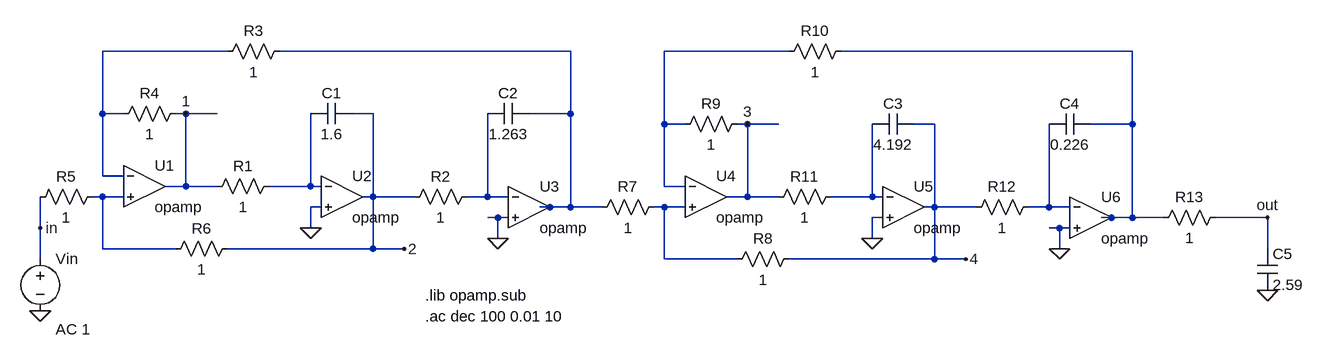
[diagram p0: schematic TS4.asc]
TS4.asc, the LTspice schematic file:
Version 4
SHEET 1 1776 680
WIRE 112 -48 -80 -48
WIRE 640 -48 192 -48
WIRE 976 -48 784 -48
WIRE 1504 -48 1056 -48
WIRE -80 48 -80 -48
WIRE -48 48 -80 48
WIRE 48 48 32 48
WIRE 96 48 48 48
WIRE 336 48 304 48
WIRE 640 48 640 -48
WIRE 640 48 576 48
WIRE 784 64 784 -48
WIRE 816 64 784 64
WIRE 912 64 896 64
WIRE 960 64 912 64
WIRE 1200 64 1168 64
WIRE 1504 64 1504 -48
WIRE 1504 64 1440 64
WIRE -80 144 -80 48
WIRE -48 144 -80 144
WIRE 48 160 48 48
WIRE 48 160 16 160
WIRE 96 160 48 160
WIRE 240 160 240 48
WIRE 240 160 176 160
WIRE 256 160 240 160
WIRE 784 160 784 64
WIRE 816 160 784 160
WIRE -80 176 -96 176
WIRE -48 176 -80 176
WIRE 336 176 336 48
WIRE 336 176 320 176
WIRE 400 176 336 176
WIRE 512 176 512 48
WIRE 512 176 480 176
WIRE 544 176 512 176
WIRE 912 176 912 64
WIRE 912 176 880 176
WIRE 960 176 912 176
WIRE 1104 176 1104 64
WIRE 1104 176 1040 176
WIRE 1120 176 1104 176
WIRE 256 192 240 192
WIRE 608 192 592 192
WIRE 640 192 640 48
WIRE 640 192 608 192
WIRE 688 192 640 192
WIRE 784 192 768 192
WIRE 816 192 784 192
WIRE 1200 192 1200 64
WIRE 1200 192 1184 192
WIRE 1264 192 1200 192
WIRE 1376 192 1376 64
WIRE 1376 192 1344 192
WIRE 1408 192 1376 192
WIRE 528 208 512 208
WIRE 544 208 528 208
WIRE 1120 208 1104 208
WIRE 1472 208 1456 208
WIRE 1504 208 1504 64
WIRE 1504 208 1472 208
WIRE 1552 208 1504 208
WIRE 1712 208 1632 208
WIRE -176 224 -176 176
WIRE 240 224 240 192
WIRE 1392 224 1376 224
WIRE 1408 224 1392 224
WIRE 528 240 528 208
WIRE 1104 240 1104 208
WIRE -80 256 -80 176
WIRE 32 256 -80 256
WIRE 336 256 336 176
WIRE 336 256 112 256
WIRE 384 256 336 256
WIRE 1392 256 1392 224
WIRE 1712 256 1712 208
WIRE -176 272 -176 224
WIRE 784 272 784 192
WIRE 896 272 784 272
WIRE 1200 272 1200 192
WIRE 1200 272 976 272
WIRE 1248 272 1200 272
FLAG -176 224 in
FLAG -176 352 0
FLAG 240 224 0
FLAG 528 240 0
FLAG 48 48 1
FLAG 384 256 2
FLAG 1104 240 0
FLAG 1392 256 0
FLAG 912 64 3
FLAG 1248 272 4
FLAG 1712 320 0
FLAG 1712 208 out
SYMBOL res -80 160 R90
WINDOW 0 0 56 VBottom 2
WINDOW 3 32 56 VTop 2
SYMATTR InstName R5
SYMATTR Value 1
SYMBOL res 128 240 R90
WINDOW 0 0 56 VBottom 2
WINDOW 3 32 56 VTop 2
SYMATTR InstName R6
SYMATTR Value 1
SYMBOL res 48 32 R90
WINDOW 0 0 56 VBottom 2
WINDOW 3 32 56 VTop 2
SYMATTR InstName R4
SYMATTR Value 1
SYMBOL res 208 -64 R90
WINDOW 0 0 56 VBottom 2
WINDOW 3 32 56 VTop 2
SYMATTR InstName R3
SYMATTR Value 1
SYMBOL res 192 144 R90
WINDOW 0 0 56 VBottom 2
WINDOW 3 32 56 VTop 2
SYMATTR InstName R1
SYMATTR Value 1
SYMBOL res 496 160 R90
WINDOW 0 0 56 VBottom 2
WINDOW 3 32 56 VTop 2
SYMATTR InstName R2
SYMATTR Value 1
SYMBOL voltage -176 256 R0
WINDOW 123 24 124 Left 2
WINDOW 39 0 0 Left 0
SYMATTR Value2 AC 1
SYMATTR InstName Vin
SYMATTR Value ""
SYMBOL OpAmps\\opamp -16 96 R0
SYMATTR InstName U1
SYMBOL OpAmps\\opamp 288 112 R0
SYMATTR InstName U2
SYMBOL OpAmps\\opamp 576 128 R0
SYMATTR InstName U3
SYMBOL cap 304 32 R90
WINDOW 0 0 32 VBottom 2
WINDOW 3 32 32 VTop 2
SYMATTR InstName C1
SYMATTR Value 1.6
SYMBOL cap 576 32 R90
WINDOW 0 0 32 VBottom 2
WINDOW 3 32 32 VTop 2
SYMATTR InstName C2
SYMATTR Value 1.263
SYMBOL res 784 176 R90
WINDOW 0 0 56 VBottom 2
WINDOW 3 32 56 VTop 2
SYMATTR InstName R7
SYMATTR Value 1
SYMBOL res 992 256 R90
WINDOW 0 0 56 VBottom 2
WINDOW 3 32 56 VTop 2
SYMATTR InstName R8
SYMATTR Value 1
SYMBOL res 912 48 R90
WINDOW 0 0 56 VBottom 2
WINDOW 3 32 56 VTop 2
SYMATTR InstName R9
SYMATTR Value 1
SYMBOL res 1072 -64 R90
WINDOW 0 0 56 VBottom 2
WINDOW 3 32 56 VTop 2
SYMATTR InstName R10
SYMATTR Value 1
SYMBOL res 1056 160 R90
WINDOW 0 0 56 VBottom 2
WINDOW 3 32 56 VTop 2
SYMATTR InstName R11
SYMATTR Value 1
SYMBOL res 1360 176 R90
WINDOW 0 0 56 VBottom 2
WINDOW 3 32 56 VTop 2
SYMATTR InstName R12
SYMATTR Value 1
SYMBOL OpAmps\\opamp 848 112 R0
SYMATTR InstName U4
SYMBOL OpAmps\\opamp 1152 128 R0
SYMATTR InstName U5
SYMBOL OpAmps\\opamp 1440 144 R0
SYMATTR InstName U6
SYMBOL cap 1168 48 R90
WINDOW 0 0 32 VBottom 2
WINDOW 3 32 32 VTop 2
SYMATTR InstName C3
SYMATTR Value 4.192
SYMBOL cap 1440 48 R90
WINDOW 0 0 32 VBottom 2
WINDOW 3 32 32 VTop 2
SYMATTR InstName C4
SYMATTR Value 0.226
SYMBOL res 1648 192 R90
WINDOW 0 0 56 VBottom 2
WINDOW 3 32 56 VTop 2
SYMATTR InstName R13
SYMATTR Value 1
SYMBOL cap 1696 256 R0
SYMATTR InstName C5
SYMATTR Value 2.59
TEXT 416 328 Left 2 !.lib opamp.sub
TEXT 416 360 Left 2 !.ac dec 100 0.01 10

The netlist it stands for:
* TS4.asc
R5 N006 in 1
R6 2 N006 1
R4 1 N001 1
R3 N002 N001 1
R1 N005 1 1
R2 N007 2 1
Vin in 0 AC 1
XU1 N001 N006 1 opamp Aol=100K GBW=10Meg  ; pins invin noninvin out
XU2 N005 0 2 opamp Aol=100K GBW=10Meg  ; pins invin noninvin out
XU3 N007 0 N002 opamp Aol=100K GBW=10Meg  ; pins invin noninvin out
C1 2 N005 1.6
C2 N002 N007 1.263
R7 N009 N002 1
R8 4 N009 1
R9 3 N003 1
R10 N004 N003 1
R11 N008 3 1
R12 N010 4 1
XU4 N003 N009 3 opamp Aol=100K GBW=10Meg  ; pins invin noninvin out
XU5 N008 0 4 opamp Aol=100K GBW=10Meg  ; pins invin noninvin out
XU6 N010 0 N004 opamp Aol=100K GBW=10Meg  ; pins invin noninvin out
C3 4 N008 4.192
C4 N004 N010 0.226
R13 out N004 1
C5 out 0 2.59
.lib opamp.sub
.ac dec 100 0.01 10
.backanno
.end

* Results of the author's LTspice run, read from the files saved beside the schematic
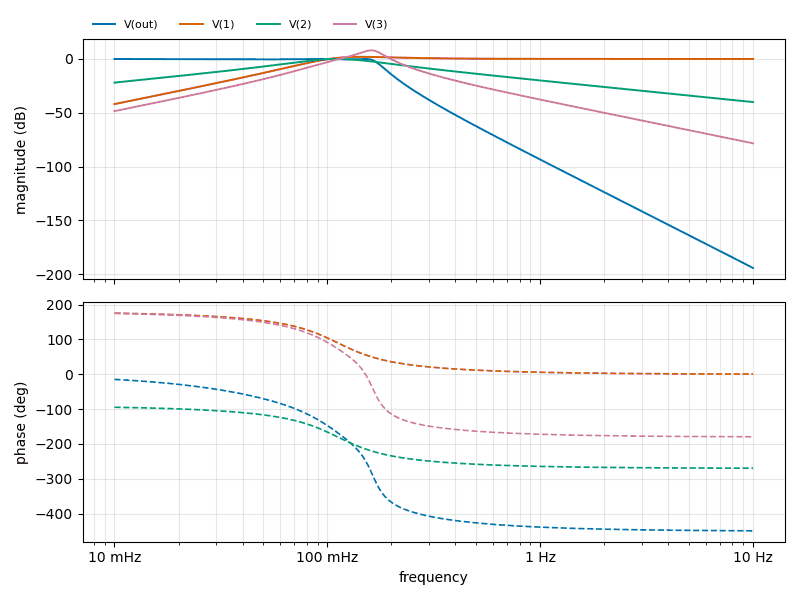
[diagram p1: AC Analysis of TS4.asc, plotted from the saved traces]
* AC Analysis, 1 run:
*   V(out): -0.04 dB at 10 mHz, -194.24 dB at 10 Hz, peak -0.01 dB at 93.33 mHz, 3 dB below the peak at 170.1 mHz
*   V(1): -41.93 dB at 10 mHz, 0.00 dB at 10 Hz, peak 1.98 dB at 144.5 mHz, 3 dB below the peak at 94.58 mHz
*   V(2): -21.97 dB at 10 mHz, -40.05 dB at 10 Hz, peak -0.00 dB at 112.2 mHz, 3 dB below the peak at 72.77 mHz and 172.2 mHz
*   V(3): -48.48 dB at 10 mHz, -78.39 dB at 10 Hz, peak 8.02 dB at 162.2 mHz, 3 dB below the peak at 140.3 mHz and 178.7 mHz